# Altium schematic sheet S100 Memory Dumper.SchDoc
size Tabloid
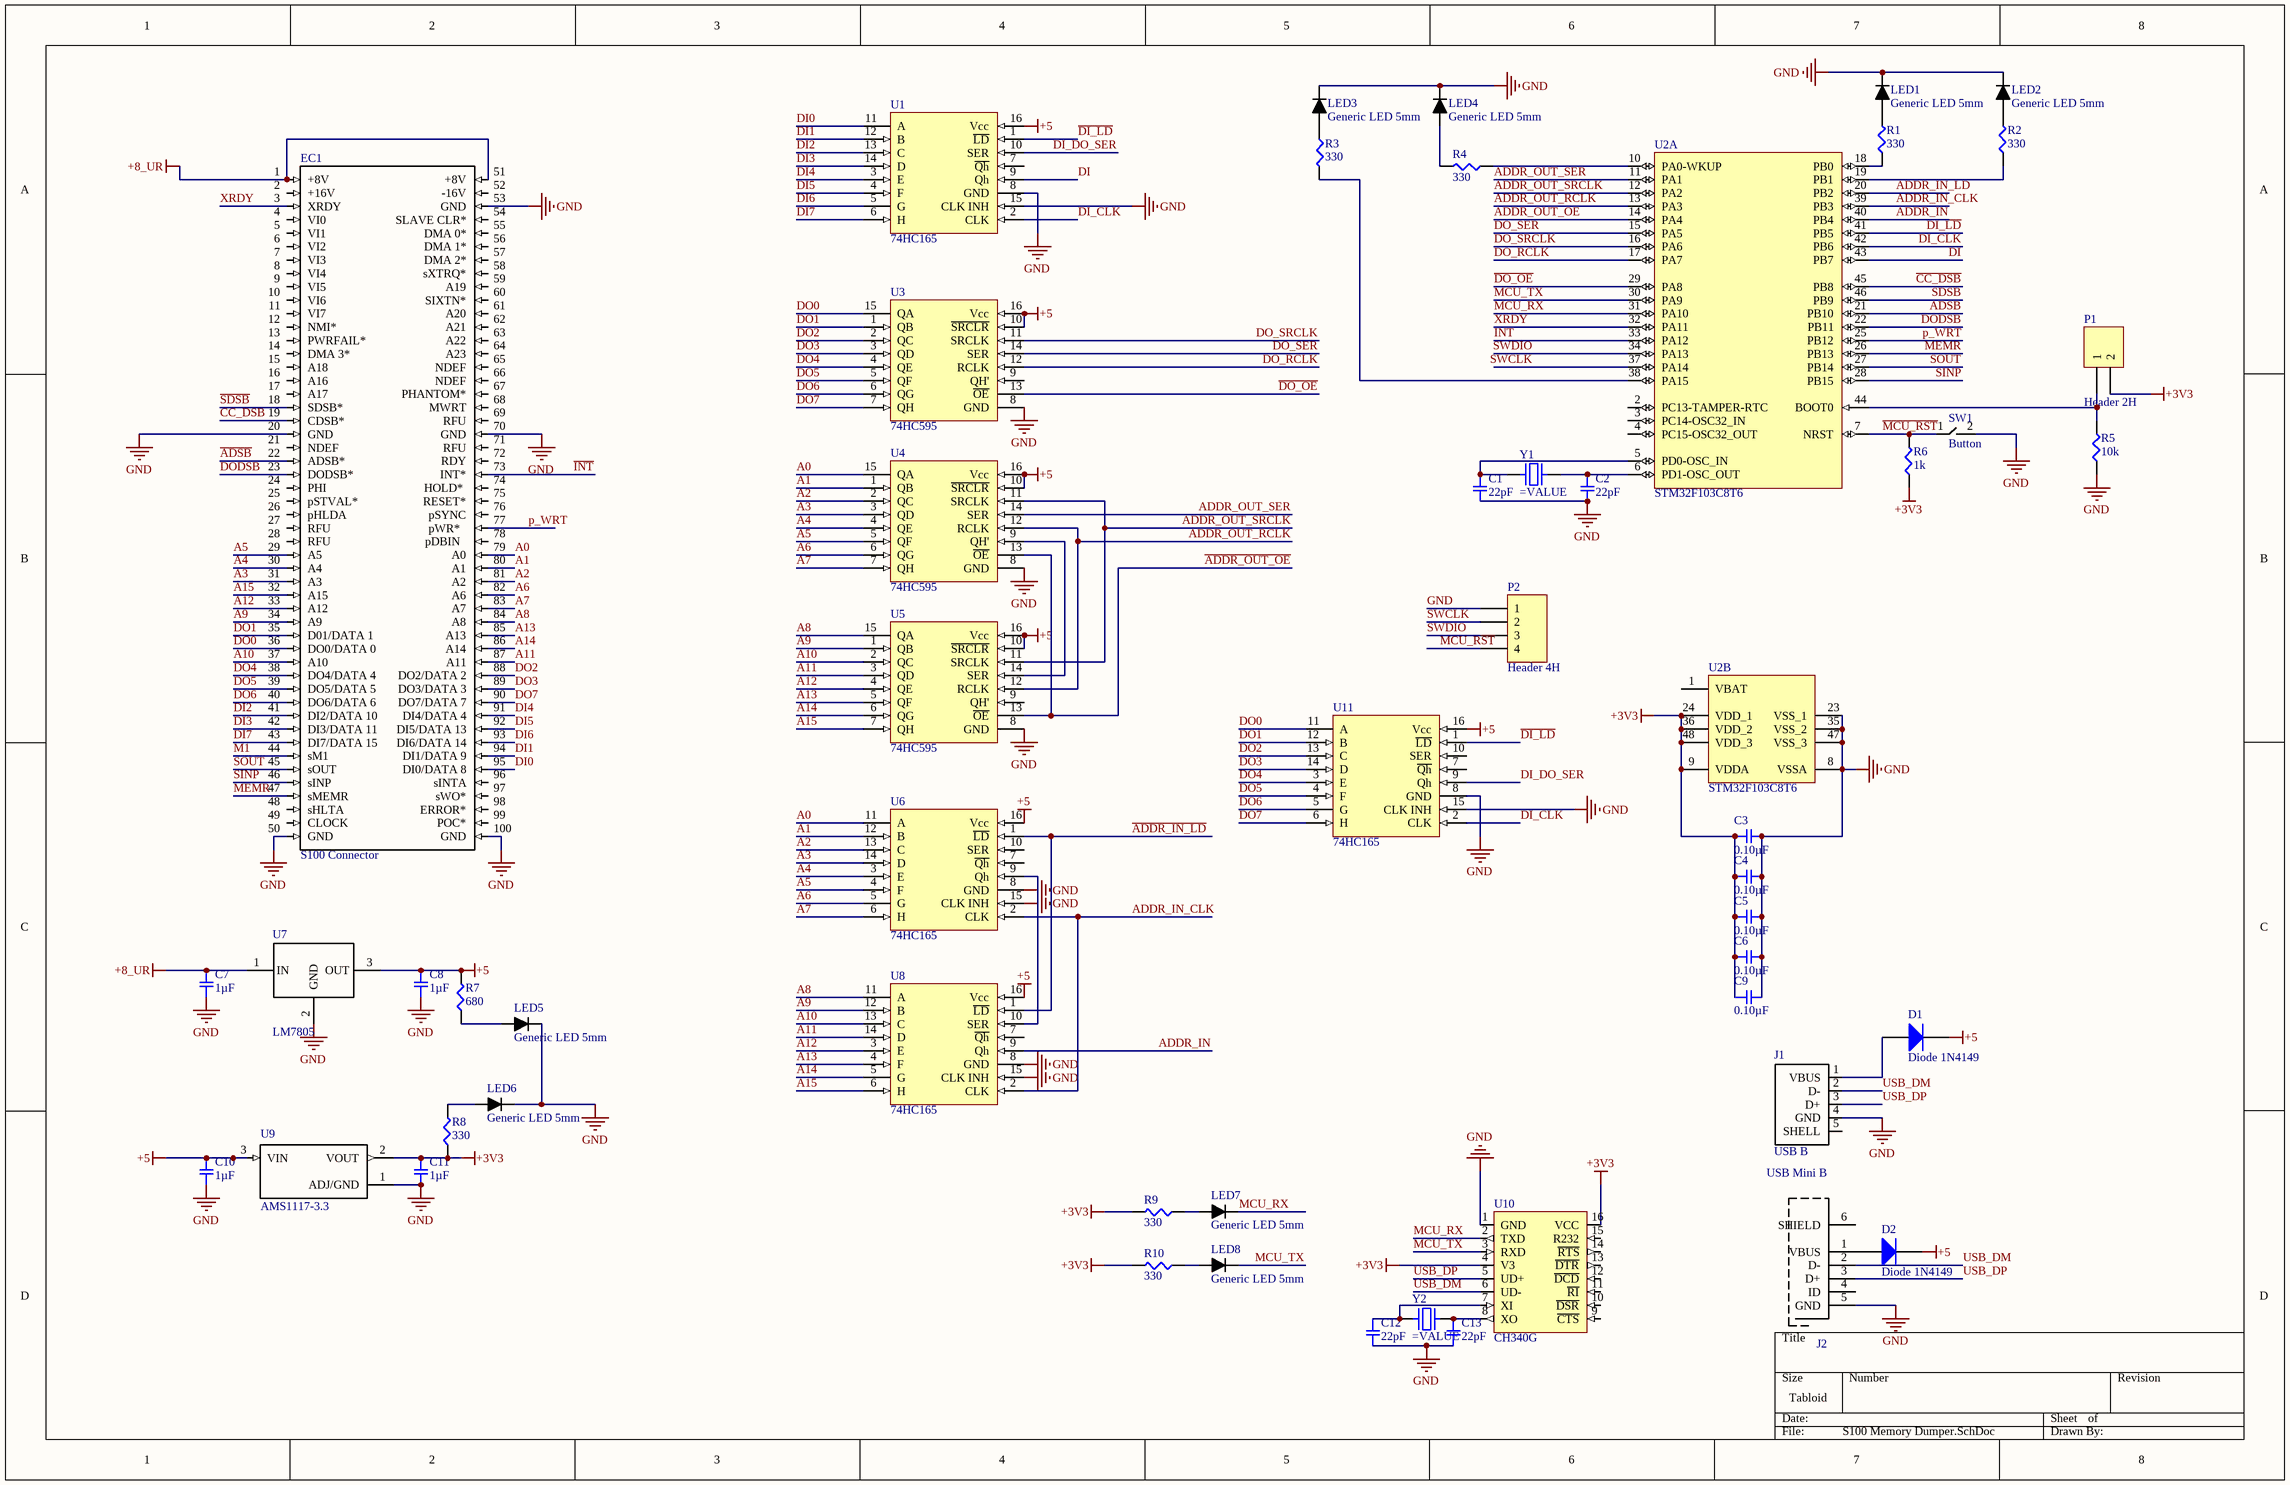
[diagram p0: S100 Memory Dumper.SchDoc]

## Parts
C1  22pF  [SMD-0805C]
C2  22pF  [SMD-0805C]
C3  0.10µF  [SMD-0805C]
C4  0.10µF  [SMD-0805C]
C5  0.10µF  [SMD-0805C]
C6  0.10µF  [SMD-0805C]
C7  1µF  [SMD-0805C]
C8  1µF  [SMD-0805C]
C9  0.10µF  [SMD-0805C]
C10  1µF  [SMD-0805C]
C11  1µF  [SMD-0805C]
C12  22pF  [SMD-0805C]
C13  22pF  [SMD-0805C]
D1  Diode 1N4149  [DO-35A]
D2  Diode 1N4149  [DO-35A]
EC1  S100 Connector  [S100]
J1  USB B  [USB B V]
J2  USB Mini B  [USB Mini B]
LED1  Generic LED 5mm  [LED 5mm THT]
LED2  Generic LED 5mm  [LED 5mm THT]
LED3  Generic LED 5mm  [LED 5mm THT]
LED4  Generic LED 5mm  [LED 5mm THT]
LED5  Generic LED 5mm  [LED 5mm THT]
LED6  Generic LED 5mm  [LED 5mm THT]
LED7  Generic LED 5mm  [LED 5mm THT]
LED8  Generic LED 5mm  [LED 5mm THT]
P1  Header 2H  [HDR1X2H]
P2  Header 4H  [HDR1X4H]
R1  330  [SMD-0805-RES]
R2  330  [SMD-0805-RES]
R3  330  [SMD-0805-RES]
R4  330  [SMD-0805-RES]
R5  10k  [SMD-0805-RES]
R6  1k  [SMD-0805-RES]
R7  680  [SMD-0805-RES]
R8  330  [SMD-0805-RES]
R9  330  [SMD-0805-RES]
R10  330  [SMD-0805-RES]
SW1  Button  [SMD_PUSHBUTTON_LCSC]
U1  74HC165  [SOIC-175-16]
U2  STM32F103C8T6  [STM-LQFP48_N]  (parts A,B of 2)
U3  74HC595  [SOIC-175-16]
U4  74HC595  [SOIC-175-16]
U5  74HC595  [SOIC-175-16]
U6  74HC165  [SOIC-175-16]
U7  LM7805  [LM7805-TO220]
U8  74HC165  [SOIC-175-16]
U9  AMS1117-3.3  [AMS1117-3.3-SOT23]
U10  CH340G  [SOIC-175-16]
U11  74HC165  [SOIC-175-16]
Y1  (no value)  [ABRACON ABLS]
Y2  (no value)  [THT_Crystal]

## Nets
+3V3: C3.1 C4.1 C5.1 C6.1 C9.1 C11.1 P1.2 R6.1 R8.1 R9.2 R10.2 U2.9(VDDA) U2.24(VDD_1) U2.36(VDD_2) U2.48(VDD_3) U9.2(VOUT) U10.4(V3) U10.16(VCC)
+5: C8.1 C10.1 D1.2(K) D2.2(K) R7.2 U1.16(Vcc) U3.10(~{SRCLR}) U3.16(Vcc) U4.10(~{SRCLR}) U4.16(Vcc) U5.10(~{SRCLR}) U5.16(Vcc) U6.16(Vcc) U7.3(OUT) U8.16(Vcc) U9.3(VIN) U11.16(Vcc)
+8_UR: C7.1 EC1.1(+8V) EC1.51(+8V) U7.1(IN)
GND: C1.2 C2.2 C3.2 C4.2 C5.2 C6.2 C7.2 C8.2 C9.2 C10.2 C11.2 C12.2 C13.2 EC1.20(GND) EC1.50(GND) EC1.53(GND) EC1.70(GND) EC1.100(GND) J1.4(GND) J2.5(GND) LED1.2(K) LED2.2(K) LED3.2(K) LED4.2(K) LED5.2(K) LED6.2(K) P2.1 R5.1 SW1.2 U1.8(GND) U1.15(CLK_INH) U2.8(VSSA) U2.23(VSS_1) U2.35(VSS_2) U2.47(VSS_3) U3.8(GND) U4.8(GND) U5.8(GND) U6.8(GND) U6.15(CLK_INH) U7.2(GND) U8.8(GND) U8.15(CLK_INH) U9.1(ADJ/GND) U10.1(GND) U11.8(GND) U11.15(CLK_INH)
~{ADDR_IN_LD}: U2.20(PB2) U6.1(~{LD}) U8.1(~{LD})
~{ADDR_OUT_OE}: U2.14(PA4) U4.13(~{OE}) U5.13(~{OE})
~{ADSB}: EC1.22(ADSB*) U2.21(PB10)
~{CC_DSB}: EC1.19(CDSB*) U2.45(PB8)
~{DI_LD}: U1.1(~{LD}) U2.41(PB5) U11.1(~{LD})
~{DO_OE}: U2.29(PA8) U3.13(~{OE})
~{DODSB}: EC1.23(DODSB*) U2.22(PB11)
~{INT}: EC1.73(INT*) U2.33(PA12)
~{MCU_RST}: P2.4 R6.2 SW1.1 U2.7(NRST)
~{SDSB}: EC1.18(SDSB*) U2.46(PB9)
A0: EC1.79(A0) U4.15(QA) U6.11(A)
A1: EC1.80(A1) U4.1(QB) U6.12(B)
A2: EC1.81(A2) U4.2(QC) U6.13(C)
A3: EC1.31(A3) U4.3(QD) U6.14(D)
A4: EC1.30(A4) U4.4(QE) U6.3(E)
A5: EC1.29(A5) U4.5(QF) U6.4(F)
A6: EC1.82(A6) U4.6(QG) U6.5(G)
A7: EC1.83(A7) U4.7(QH) U6.6(H)
A8: EC1.84(A8) U5.15(QA) U8.11(A)
A9: EC1.34(A9) U5.1(QB) U8.12(B)
A10: EC1.37(A10) U5.2(QC) U8.13(C)
A11: EC1.87(A11) U5.3(QD) U8.14(D)
A12: EC1.33(A12) U5.4(QE) U8.3(E)
A13: EC1.85(A13) U5.5(QF) U8.4(F)
A14: EC1.86(A14) U5.6(QG) U8.5(G)
A15: EC1.32(A15) U5.7(QH) U8.6(H)
ADDR_IN: U2.40(PB4) U8.9(Qh)
ADDR_IN_CLK: U2.39(PB3) U6.2(CLK) U8.2(CLK)
ADDR_OUT_RCLK: U2.13(PA3) U4.12(RCLK) U5.12(RCLK)
ADDR_OUT_SER: U2.11(PA1) U4.14(SER)
ADDR_OUT_SRCLK: U2.12(PA2) U4.11(SRCLK) U5.11(SRCLK)
DI: U1.9(Qh) U2.43(PB7)
DI0: EC1.95(DI0/DATA_8) U1.11(A)
DI1: EC1.94(DI1/DATA_9) U1.12(B)
DI2: EC1.41(DI2/DATA_10) U1.13(C)
DI3: EC1.42(DI3/DATA_11) U1.14(D)
DI4: EC1.91(DI4/DATA_4) U1.3(E)
DI5: EC1.92(DI5/DATA_13) U1.4(F)
DI6: EC1.93(DI6/DATA_14) U1.5(G)
DI7: EC1.43(DI7/DATA_15) U1.6(H)
DI_CLK: U1.2(CLK) U2.42(PB6) U11.2(CLK)
DI_DO_SER: U1.10(SER) U11.9(Qh)
DO0: EC1.36(DO0/DATA_0) U3.15(QA) U11.11(A)
DO1: EC1.35(D01/DATA_1) U3.1(QB) U11.12(B)
DO2: EC1.88(DO2/DATA_2) U3.2(QC) U11.13(C)
DO3: EC1.89(DO3/DATA_3) U3.3(QD) U11.14(D)
DO4: EC1.38(DO4/DATA_4) U3.4(QE) U11.3(E)
DO5: EC1.39(DO5/DATA_5) U3.5(QF) U11.4(F)
DO6: EC1.40(DO6/DATA_6) U3.6(QG) U11.5(G)
DO7: EC1.90(DO7/DATA_7) U3.7(QH) U11.6(H)
DO_RCLK: U2.17(PA7) U3.12(RCLK)
DO_SER: U2.15(PA5) U3.14(SER)
DO_SRCLK: U2.16(PA6) U3.11(SRCLK)
M1: EC1.44(sM1)
MCU_RX: LED7.2(K) U2.31(PA10) U10.2(TXD)
MCU_TX: LED8.2(K) U2.30(PA9) U10.3(RXD)
MEMR: EC1.47(sMEMR) U2.26(PB13)
p_WRT: EC1.77(pWR*) U2.25(PB12)
SINP: EC1.46(sINP) U2.28(PB15)
SOUT: EC1.45(sOUT) U2.27(PB14)
SWCLK: P2.2 U2.37(PA14)
SWDIO: P2.3 U2.34(PA13)
USB_DM: J1.2(D-) J2.2(D-) U10.6(UD-)
USB_DP: J1.3(D+) J2.3(D+) U10.5(UD+)
XRDY: EC1.3(XRDY) U2.32(PA11)
NetC1_1: C1.1 U2.5(PD0-OSC_IN) Y1.2
NetC2_1: C2.1 U2.6(PD1-OSC_OUT) Y1.1
NetC12_1: C12.1 U10.7(XI) Y2.1
NetC13_1: C13.1 U10.8(XO) Y2.2
NetD1_1: D1.1(A) J1.1(VBUS)
NetD2_1: D2.1(A) J2.1(VBUS)
NetLED1_1: LED1.1(A) R1.2
NetLED2_1: LED2.1(A) R2.2
NetLED3_1: LED3.1(A) R3.1
NetLED4_1: LED4.1(A) R4.2
NetLED5_1: LED5.1(A) R7.1
NetLED6_1: LED6.1(A) R8.2
NetLED7_1: LED7.1(A) R9.1
NetLED8_1: LED8.1(A) R10.1
NetP1_1: P1.1 R5.2 U2.44(BOOT0)
NetR1_1: R1.1 U2.18(PB0)
NetR2_1: R2.1 U2.19(PB1)
NetR3_2: R3.2 U2.38(PA15)
NetR4_1: R4.1 U2.10(PA0-WKUP)
NetU4_9: U4.9(QH') U5.14(SER)
NetU6_9: U6.9(Qh) U8.10(SER)

Not connected (* = marked no-connect by the designer): EC1 2(+16V) 4(VI0) 5(VI1) 6(VI2) 7(VI3) 8(VI4) 9(VI5) 10(VI6) 11(VI7) 12(NMI*) 13(PWRFAIL*) 14(DMA_3*) 15(A18 ) 16(A16  ) 17(A17) 21(NDEF) 24(PHI) 25(pSTVAL*) 26(pHLDA) 27(RFU) 28(RFU) 48(sHLTA) 49(CLOCK ) 52(-16V) 54(SLAVE_CLR*) 55(DMA_0*) 56(DMA_1*) 57(DMA_2*) 58(sXTRQ*) 59(A19) 60(SIXTN*) 61(A20) 62(A21) 63(A22) 64(A23) 65(NDEF) 66(NDEF) 67(PHANTOM*) 68(MWRT) 69(RFU) 71(RFU) 72(RDY) 74(HOLD* ) 75(RESET*) 76(pSYNC) 78(pDBIN  ) 96(sINTA) 97(sWO*) 98(ERROR*) 99(POC*); J1 5(SHELL); J2 4(ID) 6(SHIELD); U1 7(~{Qh}); U2 1(VBAT) 2(PC13-TAMPER-RTC) 3(PC14-OSC32_IN) 4(PC15-OSC32_OUT); U3 9(QH'); U5 9(QH'); U6 7(~{Qh}) 10(SER); U8 7(~{Qh}); U10 9(~{CTS}) 10(~{DSR}) 11(~{RI}) 12(~{DCD}) 13(~{DTR}) 14(~{RTS}) 15(R232); U11 7(~{Qh}) 10(SER)

## Library data of the parts
C1 C2 C12 C13 = GQM2195C1H220GB01D: CAP CER 22PF 50V NP0 0805; Manufacturer: Murata Electronics North America; Factory Stock: 0; Unit Price (USD): 1.26; Minimum Quantity: 1; Tolerance: ±2%; Temperature Coefficient: C0G, NP0; Datasheets: http://www.murata.com/~/media/webrenewal/support/library/catalog/products/capacitor/mlcc/c02e.pdf; Image: //media.digikey.com/Renders/Murata%20Renders/0805(GxM9).jpg; Digi-Key Part Number: 490-6097-1-ND; Part Number: GQM2195C1H220GB01D; Quantity Available: 2356; @ qty: 0; Packaging: Cut Tape (CT); Series: GQM; Part Status: Active; Value: 22pF; Voltage: 50V; Operating Temperature: -55°C ~ 125°C; Features: High Q, Low Loss; Ratings: -; Applications: RF, Microwave, High Frequency; Mounting Type: Surface Mount, MLCC; Package / Case: 0805 (2012 Metric); Size / Dimension: 0.079" L x 0.049" W (2.00mm x 1.25mm); Height - Seated (Max): -; Thickness (Max): 0.037" (0.95mm); Lead Spacing: -; Lead Style: -
C3-C6 C9 = GCD21BR71H104KA01L: CAP CER 0.1UF 50V X7R 0805; Manufacturer: Murata Electronics North America; Factory Stock: 0; Unit Price (USD): 0.24; Minimum Quantity: 1; Tolerance: ±10%; Datasheets: http://www.murata.com/~/media/webrenewal/support/library/catalog/products/capacitor/mlcc/c03e.ashx; Image: //media.digikey.com/Renders/Murata%20Renders/0805%28GxM6%29.jpg; Digi-Key Part Number: 490-11955-1-ND; Part Number: GCD21BR71H104KA01L; Quantity Available: 157; @ qty: 0; Packaging: Cut Tape (CT); Series: GCD; Part Status: Active; Value: 0.10µF; Voltage: 50V; Temperature Coefficient: X7R; Operating Temperature: -55°C ~ 125°C; Features: -; Ratings: AEC-Q200; Applications: Automotive; Mounting Type: Surface Mount, MLCC; Package / Case: 0805 (2012 Metric); Size / Dimension: 0.079" L x 0.049" W (2.00mm x 1.25mm); Height - Seated (Max): -; Thickness (Max): 0.049" (1.25mm); Lead Spacing: -; Lead Style: -
C7 C8 C10 C11 = GCJ219R71C105KA01D: CAP CER 1UF 16V X7R 0805; Manufacturer: Murata Electronics North America; Factory Stock: 0; Unit Price (USD): 0.29; Minimum Quantity: 1; Tolerance: ±10%; Datasheets: http://www.murata.com/~/media/webrenewal/support/library/catalog/products/capacitor/mlcc/c03e.ashx; Image: //media.digikey.com/Renders/Murata%20Renders/0805%20(2012%20Metric)%20.85mm.jpg; Digi-Key Part Number: 490-5800-1-ND; Part Number: GCJ219R71C105KA01D; Quantity Available: 140338; @ qty: 0; Packaging: Cut Tape (CT); Series: GCJ; Part Status: Active; Value: 1µF; Voltage: 16V; Temperature Coefficient: X7R; Operating Temperature: -55°C ~ 125°C; Features: Soft Termination; Ratings: AEC-Q200; Applications: Automotive, Boardflex Sensitive; Mounting Type: Surface Mount, MLCC; Package / Case: 0805 (2012 Metric); Size / Dimension: 0.079" L x 0.049" W (2.00mm x 1.25mm); Height - Seated (Max): -; Thickness (Max): 0.037" (0.95mm); Lead Spacing: -; Lead Style: -
D1 D2 = Diode 1N4149: Computer Diode; Published: 8-Jun-2000; LatestRevisionDate: 17-Jul-2002; LatestRevisionNote: Re-released for DXP Platform.; DatasheetVersion: 1989; PackageVersion: 1989; PackageReference: DO-35A; Publisher: Altium Limited; PackageDescription: Diode, Axial; Body 4.6 x 1.9 mm (LxDia. max), Lead Dia. 0.53 mm (max); Code_JEDEC: DO-204-AH; ComponentLink1Description: Manufacturer Link; ComponentLink1URL: http://www.national.com/
J2 = USB Mini B: MINI USB A - 5POS Horizontal through hole; MF: Wurth Electronics; MP: 651005136521; Package: None; Price: 1.78 USD; Availability: Good; SnapEDA_Link: https://www.snapeda.com/symbols-footprints/651005136521/Wurth%20Electronics%20Inc/view-part/?ref=snap; Value: *
P1 = Header 2H: Header, 2-Pin, Right Angle; LatestRevisionDate: 17-Jul-2002; LatestRevisionNote: Re-released for DXP Platform.; Publisher: Altium Limited
P2 = Header 4H: Header, 4-Pin, Right Angle; LatestRevisionDate: 17-Jul-2002; LatestRevisionNote: Re-released for DXP Platform.; Publisher: Altium Limited
R1-R4 R8-R10 = ERJ-6ENF3300V: RES SMD 330 OHM 1% 1/8W 0805; Manufacturer: Panasonic Electronic Components; Factory Stock: 0; Unit Price (USD): 0.00729; @ qty: 1500; Minimum Quantity: 1; Power (Watts): 0.125W, 1/8W; Temperature Coefficient: ±100ppm/°C; Part Number: ERJ-6ENF3300V; Datasheets: http://industrial.panasonic.com/www-cgi/jvcr13pz.cgi?E+PZ+3+AOA0002+ERJ6ENF3300V+7+WW; Image: //media.digikey.com/Renders/Panasonic%20Renders/ERJ-0805%20Pkg.jpg; Digi-Key Part Number: P330CCT-ND; Quantity Available: 297770; Packaging: Cut Tape (CT); Series: ERJ; Part Status: Active; Value: 330; Tolerance: ±1%; Composition: Thick Film; Features: Automotive AEC-Q200; Operating Temperature: -55°C ~ 155°C; Package / Case: 0805 (2012 Metric); Supplier Device Package: 0805; Size / Dimension: 0.079" L x 0.049" W (2.00mm x 1.25mm); Height - Seated (Max): 0.028" (0.70mm); Number of Terminations: 2; Failure Rate: -
R5 = ERJ-P06F1002V: RES SMD 10K OHM 1% 1/2W 0805; Manufacturer: Panasonic Electronic Components; Factory Stock: 0; Unit Price (USD): 0.02534; @ qty: 1500; Minimum Quantity: 1; Power (Watts): 0.5W, 1/2W; Temperature Coefficient: ±100ppm/°C; Part Number: ERJ-P06F1002V; Datasheets: https://industrial.panasonic.com/cdbs/www-data/pdf/RDA0000/AOA0000C243.pdf; Image: //media.digikey.com/Renders/Panasonic%20Renders/ERJ-0805%20Pkg.jpg; Digi-Key Part Number: P16059CT-ND; Quantity Available: 42054; Packaging: Cut Tape (CT); Series: ERJ; Part Status: Active; Value: 10k; Tolerance: ±1%; Composition: Thick Film; Features: Automotive AEC-Q200, Pulse Withstanding; Operating Temperature: -55°C ~ 155°C; Package / Case: 0805 (2012 Metric); Supplier Device Package: 0805; Size / Dimension: 0.079" L x 0.049" W (2.00mm x 1.25mm); Height - Seated (Max): 0.028" (0.70mm); Number of Terminations: 2; Failure Rate: -
R6 = ERJ-P06F1001V: RES SMD 1K OHM 1% 1/2W 0805; Manufacturer: Panasonic Electronic Components; Factory Stock: 0; Unit Price (USD): 0.02534; @ qty: 1500; Minimum Quantity: 1; Power (Watts): 0.5W, 1/2W; Temperature Coefficient: ±100ppm/°C; Part Number: ERJ-P06F1001V; Datasheets: https://industrial.panasonic.com/cdbs/www-data/pdf/RDA0000/AOA0000C243.pdf; Image: //media.digikey.com/Renders/Panasonic%20Renders/ERJ-0805%20Pkg.jpg; Digi-Key Part Number: P16058CT-ND; Quantity Available: 161264; Packaging: Cut Tape (CT); Series: ERJ; Part Status: Active; Value: 1k; Tolerance: ±1%; Composition: Thick Film; Features: Automotive AEC-Q200, Pulse Withstanding; Operating Temperature: -55°C ~ 155°C; Package / Case: 0805 (2012 Metric); Supplier Device Package: 0805; Size / Dimension: 0.079" L x 0.049" W (2.00mm x 1.25mm); Height - Seated (Max): 0.028" (0.70mm); Number of Terminations: 2; Failure Rate: -
R7 = ERJ-6ENF6800V: RES SMD 680 OHM 1% 1/8W 0805; Manufacturer: Panasonic Electronic Components; Factory Stock: 0; Unit Price (USD): 0.00729; @ qty: 1500; Minimum Quantity: 1; Power (Watts): 0.125W, 1/8W; Temperature Coefficient: ±100ppm/°C; Part Number: ERJ-6ENF6800V; Datasheets: http://industrial.panasonic.com/www-cgi/jvcr13pz.cgi?E+PZ+3+AOA0002+ERJ6ENF6800V+7+WW; Image: //media.digikey.com/Renders/Panasonic%20Renders/ERJ-0805%20Pkg.jpg; Digi-Key Part Number: P680CCT-ND; Quantity Available: 63553; Packaging: Cut Tape (CT); Series: ERJ; Part Status: Active; Value: 680; Tolerance: ±1%; Composition: Thick Film; Features: Automotive AEC-Q200; Operating Temperature: -55°C ~ 155°C; Package / Case: 0805 (2012 Metric); Supplier Device Package: 0805; Size / Dimension: 0.079" L x 0.049" W (2.00mm x 1.25mm); Height - Seated (Max): 0.028" (0.70mm); Number of Terminations: 2; Failure Rate: -
SW1 = Button: LCSC Push button SMD
U2 = STM32F103C8T6: ARM Cortex-M3 32-bit MCU, 64 KB Flash, 20 KB Internal RAM, 37 I/Os, 48-pin LQFP, -40 to 85 degC, Tray; A/D Converter: 2x12-bit (10 Channel); FLASH Size (Prog) (kB): 64; I/Os (High Current): 37; Internal RAM Size (kB): 20; Operating Frequency(F) (Processor speed) (MHz): 72; Supply Voltage(Vcc) min (V): 2; DatasheetVersion: Rev. 16; PackageVersion: Rev. 6, 06/2013; PackageReference: LQFP48; PackageDescription: 48-Pin Low Profile Quad Flat Package, 7 x 7 mm Body, 0.5 mm Pitch; Supplier 1: Digi-Key; Supplier Part Number 1: 497-6063-ND; Supplier 2: Farnell; Supplier Part Number 2: 1447637; Supplier 3: Newark; Supplier Part Number 3: 59M2182; Supplier 4: Newark; Supplier Part Number 4: 57P1222; Supplier 5: Mouser; Supplier Part Number 5: 511-STM32F103C8T6; Core: ARM Cortex-M3; Packing: Tray; Mounting Technology: Surface Mount; PartNumber: STM32F103C8T6; ComponentLink1Description: Manufacturer URL; ComponentLink1URL: http://www.st.com/web/en/home.html; ComponentLink2Description: Datasheet; ComponentLink2URL: http://www.st.com/st-web-ui/static/active/en/resource/technical/document/datasheet/CD00161566.pdf; ComponentLink3Description: Package Specification; ComponentLink3URL: http://www.st.com/st-web-ui/static/active/en/resource/technical/document/datasheet/DM00058181.pdf
U7 = LM7805: LM7805 Linear Voltage Regulator
U9 = AMS1117-3.3: Sot223/Pkg 1-Amp 3.3-Volt Low Drop Out Voltage Regulatator; MF: Advanced Monolithic Systems; SnapEDA_Link: https://www.snapeda.com/parts/AMS1117-3.3/Advanced%20Monolithic%20Systems/view-part/?ref=snap; Price: None; MP: AMS1117-3.3; Availability: Unavailable; Package: None; Value: *
Y1 = Abracon Crystal ABLS: SMT Crystal
Y2 = THT Crystal: SMT Crystal